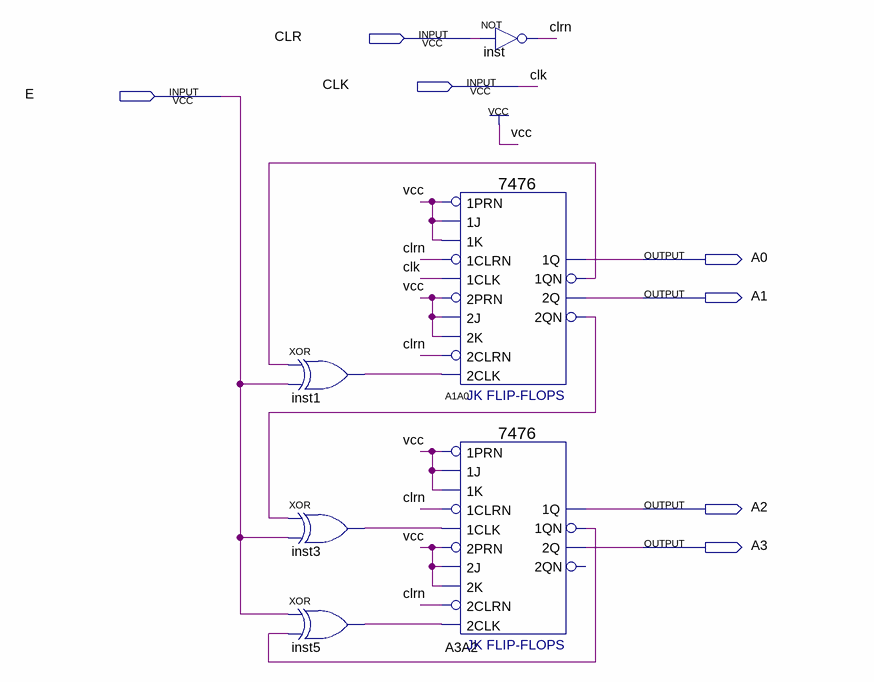
[diagram p0: schematic sheet]
// Quartus schematic Question3alt2.bdf as structural Verilog: 6 symbols, 7 pins
module Question3alt2 (
  input  CLR,
  input  CLK,
  input  E,
  output A0,
  output A1,
  output A2,
  output A3
);

  wire A1A0_1qn, A1A0_2qn, A3A2_1qn, clrn, inst1_out, inst3_out, inst5_out;

  xor inst1 (inst1_out, A1A0_1qn, E);
  xor inst3 (inst3_out, A1A0_2qn, E);
  xor inst5 (inst5_out, E, A3A2_1qn);
  not inst (clrn, CLR);
  \7476  A1A0 (
    .\1J (1'b1), .\1K (1'b1), .\1PRN (1'b1), .\2PRN (1'b1), .\2J (1'b1), .\1CLK (CLK), .\1CLRN (clrn),
    .\2K (1'b1), .\2CLRN (clrn), .\2CLK (inst1_out), .\2QN (A1A0_2qn), .\1Q (A0), .\2Q (A1), .\1QN (A1A0_1qn));
  \7476  A3A2 (
    .\1J (1'b1), .\1K (1'b1), .\1PRN (1'b1), .\2PRN (1'b1), .\2J (1'b1), .\1CLK (inst3_out), .\1CLRN (clrn),
    .\2K (1'b1), .\2CLRN (clrn), .\2CLK (inst5_out), .\1Q (A2), .\2Q (A3), .\1QN (A3A2_1qn));  // open: 2QN
endmodule
